# EAGLE design FM-Radio-Simple-Receiver-2 (EAGLE 7.2.0)
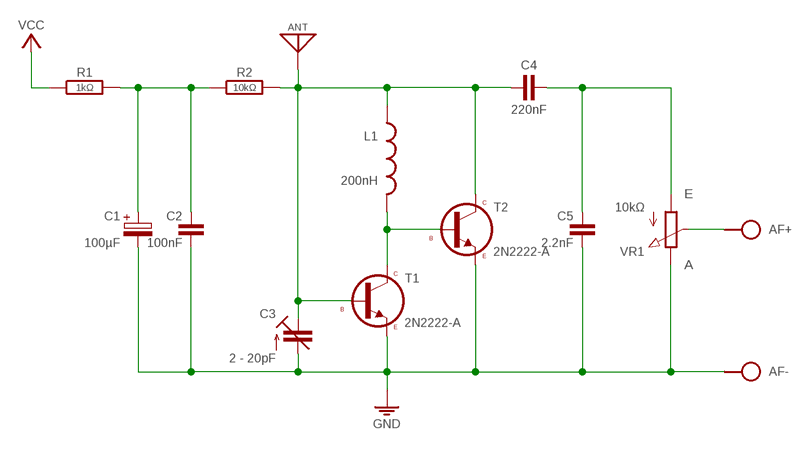
[diagram p0: schematic, sheet 1]

## Parts
AF  SPAD+-+-  [SPAD+-]
ANT  ANT  [SPAD]
BAT  VCC_GNDL  [SPAD-+]
C1  100µF  CPOLE2,5-5/V  [E2,5-5/V]
C2  100nF  C025-024X044  [C025-024X044]
C3  2 - 20pF  C-TR-PH20127-2-1  [CTRIMBB]
C4  220nF  C-H050-020X044  [C050-020X044]
C5  2.2nF  C050-020X036/V  [C050-020X036/V]
L1  200nH  L10/10X  [L-10/10X]
R1  1kΩ  R-H0204/10-V  [0204/10-V]
R2  10kΩ  R-H0204/10-V  [0204/10-V]
T1  2N2222-A  [TO92-A]
T2  2N2222-A  [TO92-A]
VR1  10kΩ  POT-3P  [CONN-3P]

## Nets
GND: AF.1 BAT.1 C1.- C2.2 C3.1(A) C5.2 T1.1(E) T2.1(E) VR1.3(E)
N$1: ANT.1 C3.2(E) C4.1 L1.1 R2.2 T1.2(B) T2.3(C)
N$2: C1.+ C2.1 R1.2 R2.1
N$3: C4.2 C5.1 VR1.1(A)
N$5: L1.2 T1.3(C) T2.2(B)
N$6: AF.2 VR1.2(S)
VCC: BAT.2 R1.1

## Library data of the parts
AF = pad:SPAD+-
ANT = pad:ANT
BAT = pad:VCC_GND
C1 = c:CPOL: POLARIZED CAPACITOR, European symbol
C2 C5 = c:C: CAPACITOR, European symbol
C3 = cap-trim:C-TR-PH20127
C4 = c:C-H
L1 = l:L: Potentiometers Beckman, Copal, Piher, Spectrol, Schukat Created by librarian@cadsoft.de
R1 R2 = r:R-H
T1 T2 = t:2N2222
VR1 = r:POT

## Board
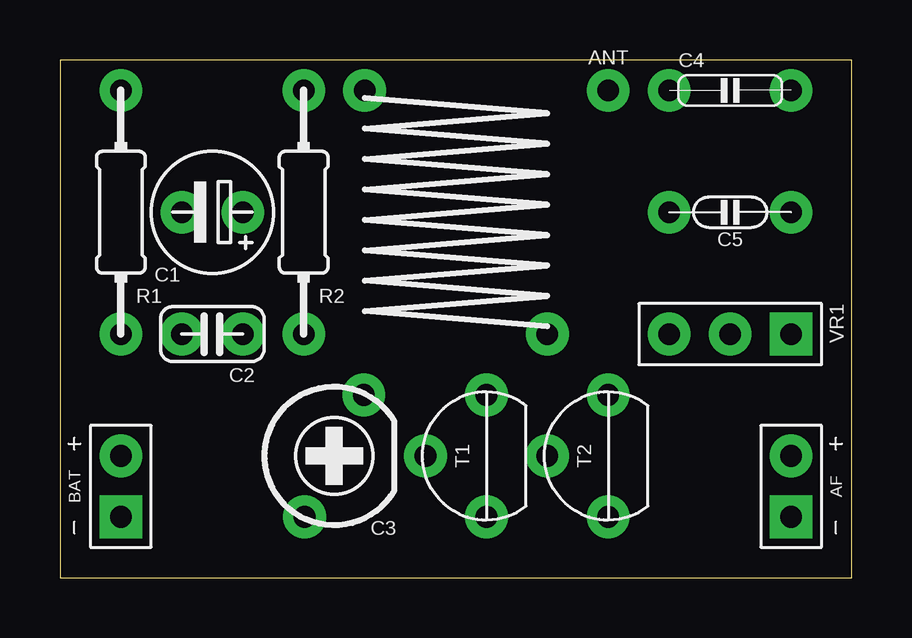
[diagram p1: board, top side]
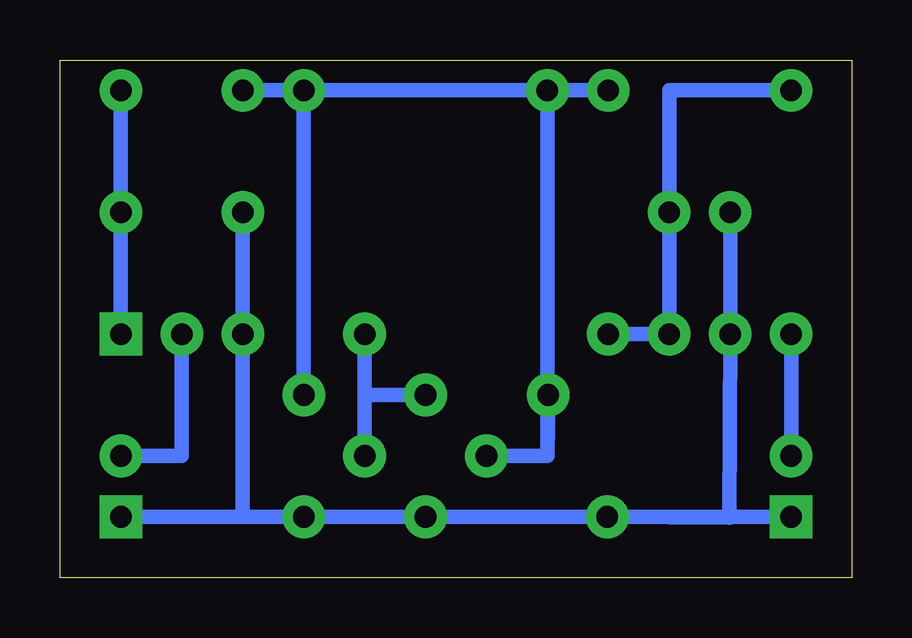
[diagram p2: board, bottom side, seen from below]

Size 33.02 x 21.59 mm. Coordinates in mm from the lower left corner, seen from the top.
Outline: 0,0 33.02,0 33.02,21.59 0,21.59 0,0
Copper layers (1*16): Top 0.035mm / dielectric 1.5mm / Bottom 0.035mm
Design rules "default": minimum track width 10mil, minimum drill 24mil, track to track 8mil, track to pad 8mil, pad to pad 8mil, via to via 8mil, smd to smd 8mil, copper to edge 40mil, drill to drill 8mil, minimum pad ring 10mil, minimum via ring 8mil, stop-mask expansion 4mil, vias tented up to drill 0mil, thermal gap 10mil

### Footprints (pad centres in the part's own frame; a part is rotated, then mirrored left to right if it is on the bottom)
SPAD+- = drill 0.9 pad 1.778 square: 1 0,-1.27 | drill 0.9 pad 1.778: 2 0,1.27
SPAD = drill 0.9 pad 1.778: 1 0,0
SPAD-+ = drill 0.9 pad 1.778 square: 1 0,-1.27 | drill 0.9 pad 1.778: 2 0,1.27
E2,5-5/V = drill 0.9 pad 1.778: + 0,-1.27; - 0,1.27
C025-024X044 = drill 0.9 pad 1.778: 1 -1.27,0; 2 1.27,0
CTRIMBB = drill 0.9 pad 1.778: 1 -2.54,2.5; 2 2.54,0.04
C050-020X044 = drill 0.9 pad 1.778: 1 -2.54,0; 2 2.54,0
C050-020X036/V = drill 0.9 pad 1.778: 1 0,-2.54; 2 0,2.54
L-10/10X = drill 0.9 pad 1.778: 1 -5.08,2.54; 2 2.54,-7.62
0204/10-V = drill 0.9 pad 1.778: 1 0,5.08; 2 0,-5.08
TO92-A = drill 0.9 pad 1.778: 1 0,2.54; 2 2.54,0; 3 0,-2.54
CONN-3P = drill 0.9 pad 1.778 square: 1 0,2.54 | drill 0.9 pad 1.778: 2 0,0; 3 0,-2.54

### Placement (x,y rotation side)
AF  30.48,3.81 0 top
ANT  22.86,20.32 270 top
BAT  2.54,3.81 0 top
C1  6.35,15.24 90 top
C2  6.35,10.16 180 top
C3  12.7,5.08 90 top
C4  27.94,20.32 0 top
C5  27.94,15.24 90 top
L1  17.78,17.78 0 top
R1  2.54,15.24 180 top
R2  10.16,15.24 180 top
T1  17.78,5.08 180 top
T2  22.86,5.08 180 top
VR1  27.94,10.16 270 top

### Tracks (layer width: path | path; a pad name or v marks a point on that pad's centre or on a via)
GND
  Bottom 0.61: C3.1 T1.1 T2.1 25.4,2.54 | 25.4,2.54 VR1.3 C5.2 | C3.1 5.12,2.5 C2.2 C1.- | C3.1 BAT.1 | 25.4,2.54 AF.1
N$1
  Bottom 0.61: T2.3 ANT.1 | C4.1 ANT.1 | T1.2 12.7,5.08 | 12.7,5.08 L1.1 R2.2 ANT.1 | C3.2 12.7,5.08
N$2
  Bottom 0.61: R1.2 7.62,20.32 C1.+ C2.1 R2.1
N$3
  Bottom 0.61: C4.2 C5.1 VR1.1
N$5
  Bottom 0.61: L1.2 20.32,7.62 | T2.2 20.32,7.62 | 20.32,7.62 T1.3
N$6
  Bottom 0.61: AF.2 27.94,5.08 VR1.2
VCC
  Bottom 0.61: R1.1 BAT.2